# Altium schematic sheet Motor-Z.SchDoc: Motor-Z
size Letter; DocumentNumber: 4; SheetNumber: 7; SheetTotal: 11
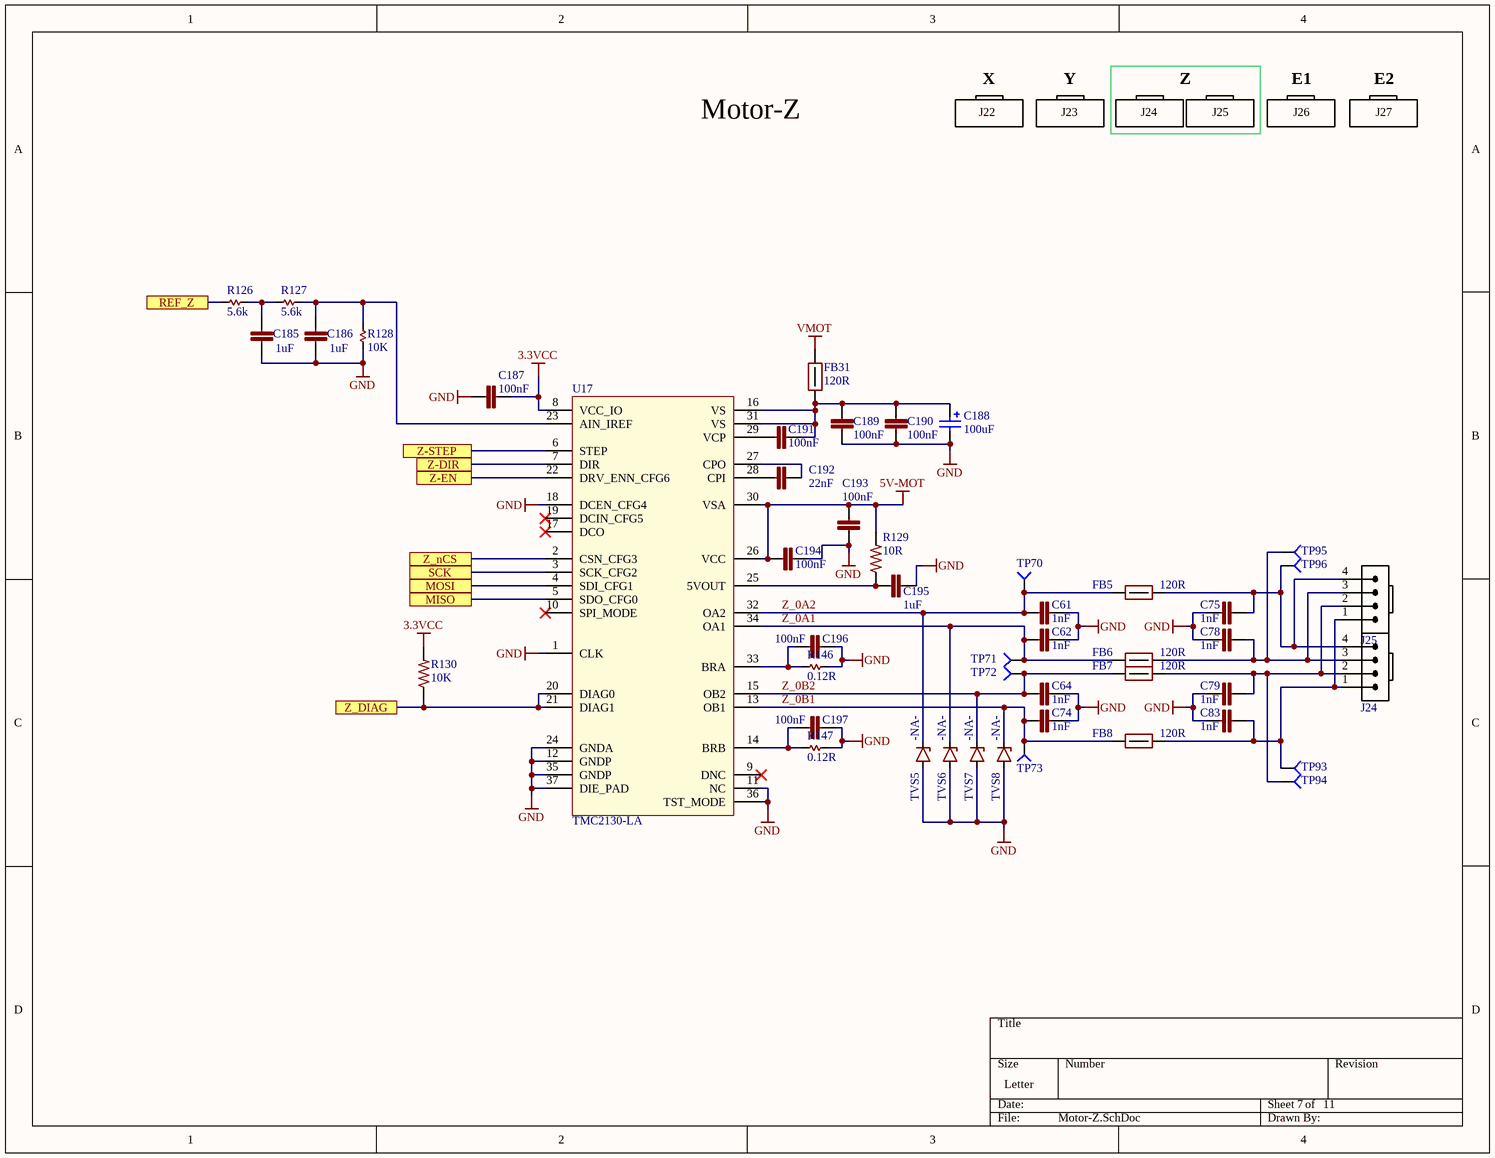
[diagram p0: Motor-Z.SchDoc]

## Parts
C61  1nF  [C0402]
C62  1nF  [C0402]
C64  1nF  [C0402]
C74  1nF  [C0402]
C75  1nF  [C0402]
C78  1nF  [C0402]
C79  1nF  [C0402]
C83  1nF  [C0402]
C185  1uF  [C0402]
C186  1uF  [C0402]
C187  100nF  [C0402]
C188  value 100uF  [CAP-ELEC-063063077]  (hidden comment: UWT1V101MCL1GS)
C189  100nF  [C0603]
C190  100nF  [C0603]
C191  100nF  [C0603]
C192  22nF  [C0402]
C193  100nF  [C0402]
C194  100nF  [C0402]
C195  1uF  [C0402]
C196  100nF  [C0603]
C197  100nF  [C0603]
FB5  120R  [FB0603]
FB6  120R  [FB0603]
FB7  120R  [FB0603]
FB8  120R  [FB0603]
FB31  120R  [FB0603]
J24  Molex 0705430038  [4POL254 PIN-IN-PASTE]  (value not drawn)
J25  Molex 0705430038  [4POL254 PIN-IN-PASTE]  (value not drawn)
R126  5.6k  [R0402]
R127  5.6k  [R0402]
R128  10K  [R0402]
R129  10R  [R0402]
R130  10K  [R0402]
R146  0.12R  [R1206]
R147  0.12R  [R1206]
TP70  TP4  [TP-2]  (value not drawn)  (no BOM)
TP71  TP4  [TP-2]  (value not drawn)  (no BOM)
TP72  TP4  [TP-2]  (value not drawn)  (no BOM)
TP73  TP4  [TP-2]  (value not drawn)  (no BOM)
TP93  TP4  [TP-2]  (value not drawn)  (no BOM)
TP94  TP4  [TP-2]  (value not drawn)  (no BOM)
TP95  TP4  [TP-2]  (value not drawn)  (no BOM)
TP96  TP4  [TP-2]  (value not drawn)  (no BOM)
TVS5  value -NA-  [SMF]  (hidden comment: TVS 30V SMF)
TVS6  value -NA-  [SMF]  (hidden comment: TVS 30V SMF)
TVS7  value -NA-  [SMF]  (hidden comment: TVS 30V SMF)
TVS8  value -NA-  [SMF]  (hidden comment: TVS 30V SMF)
U17  TMC2130-LA  [QFN36-50P500X600X900_HS-37N]

## Ports
MISO, MOSI, REF_Z, SCK, Z-DIR, Z-EN, Z-STEP, Z_DIAG, Z_nCS

## Nets
3.3VCC: C187.1 R130.2 U17.8(VCC_IO)
5V-MOT: C193.2 C194.2 R129.2 U17.26(VCC) U17.30(VSA)
GND: C61.2 C62.2 C64.2 C74.2 C75.1 C78.1 C79.1 C83.1 C185.2 C186.2 C187.2 C188.2 C189.1 C190.1 C193.1 C194.1 C195.2 C196.1 C197.1 R128.1 R146.2 R147.2 TVS5.A TVS6.A TVS7.A TVS8.A U17.1(CLK) U17.11(NC) U17.12(GNDP) U17.18(DCEN_CFG4) U17.24(GNDA) U17.35(GNDP) U17.36(TST_MODE) U17.37(DIE_PAD)
VMOT: FB31.2
MISO: U17.5(SDO_CFG0) ; port MISO
MOSI: U17.4(SDI_CFG1) ; port MOSI
REF_Z: R126.1 ; port REF_Z
SCK: U17.3(SCK_CFG2) ; port SCK
Z-DIR: U17.7(DIR) ; port Z-DIR
Z-EN: U17.22(DRV_ENN_CFG6) ; port Z-EN
Z-STEP: U17.6(STEP) ; port Z-STEP
Z_0A1: C62.1 FB6.1 TP71.1 TVS6.K U17.34(OA1)
Z_0A2: C61.1 FB5.1 TP70.1 TVS5.K U17.32(OA2)
Z_0B1: C74.1 FB8.1 TP73.1 TVS8.K U17.13(OB1)
Z_0B2: C64.1 FB7.1 TP72.1 TVS7.K U17.15(OB2)
Z_DIAG: R130.1 U17.20(DIAG0) U17.21(DIAG1) ; port Z_DIAG
Z_nCS: U17.2(CSN_CFG3) ; port Z_nCS
NetC75_2: C75.2 FB5.2 J24.4 J25.4 TP96.1
NetC78_2: C78.2 FB6.2 J24.3 J25.3 TP95.1
NetC79_2: C79.2 FB7.2 J24.2 J25.2 TP94.1
NetC83_2: C83.2 FB8.2 J24.1 J25.1 TP93.1
NetC185_1: C185.1 R126.2 R127.1
NetC186_1: C186.1 R127.2 R128.2 U17.23(AIN_IREF)
NetC188_1: C188.1 C189.2 C190.2 C191.2 FB31.1 U17.16(VS) U17.31(VS)
NetC191_1: C191.1 U17.29(VCP)
NetC192_1: C192.1 U17.28(CPI)
NetC192_2: C192.2 U17.27(CPO)
NetC195_1: C195.1 R129.1 U17.25(5VOUT)
NetC196_2: C196.2 R146.1 U17.33(BRA)
NetC197_2: C197.2 R147.1 U17.14(BRB)

Not connected (* = marked no-connect by the designer): U17 9(DNC)* 10(SPI_MODE)* 17(DCO)* 19(DCIN_CFG5)*

## Notes on the sheet
- X
- Y
- Z
- E1
- E2
- Motor-Z
- J22
- J23
- J24
- J25
- J26
- J27

## Library data of the parts
C61 C62 C64 C74 C75 C78 C79 C83 = CAP 1nF 50V 0402 X7R: 1000pF 50V Ceramic Capacitor X7R 0402 (1005 Metric) 0.039" L x 0.020" W (1.00mm x 0.50mm); MANUFACTURER: Murata; MANUFACTURER #: GRM155R71H102KA01D; PART: 1nF 50V X7R 0402; PART DESCRIPTION: 1000pF ±10% 50V Ceramic Capacitor X7R 0402 (1005 Metric); TOLERANCE: 10%; VALUE: 1nF; DISTRIBUTOR #: 490-1303-2-ND; DISTRIBUTOR: Digi-Key Electronics; EE_SPEC: 50V
C185 C186 = GRM155R60J105KE19D: CAP CER 0402 1uF 6.3V 10% X5R; MANUFACTURER: Murata; PART: 1uF 6.3V X5R 0402; PART DESCRIPTION: 1µF ±10% 6.3V Ceramic Capacitor X5R 0402 (1005 Metric); VALUE: 1uF; MANUFACTURER #: GRM155R60J105KE19D; DISTRIBUTOR #: 490-1320-2-ND; DISTRIBUTOR: Digi-Key Electronics; TOLERANCE: 10%; EE_SPEC: 1uF 6.3V X5R 0402
C187 C193 C194 = GRM155R71C104KA88D: CAP CER 0402 100nF 16V 10% X7R; Manufacturer: Murata; PART: 0.1uF 16V X7R 0402; Part Description: 0.10µF ±10% 16V Ceramic Capacitor X7R 0402 (1005 Metric); EE_SPEC: 100nF 16V X7R 0402; VALUE: 100nF; MANUFACTURER #: GRM155R71C104KA88D; DISTRIBUTOR #: 490-3261-2-ND; DISTRIBUTOR: Digi-Key Electronics; Tolerance: 10%
C188 = UWT1V101MCL1GS: CAP ALUM 100UF 35V 20% SMD; Manufacturer: Nichicon; PART: 100uF 35V SMD Al-El; Part Description: 100µF 35V Aluminum Capacitors Radial, Can - SMD 1000 Hrs @ 105°C; EE_SPEC: 100uF 35V Al-El; MANUFACTURER #: UWT1V101MCL1GS; DISTRIBUTOR #: 493-2203-2-ND; DISTRIBUTOR: Digi-Key Electronics; Tolerance: 20%
C189-C191 C196 C197 = C0603C104K5RACTU: CAP CER 0603 100nF 50V 10% X7R; Manufacturer: Kemet; Part Description: 0.1µF ±10% 50V Ceramic Capacitor X7R 0603 (1608 Metric); EE_SPEC: 100nF 50V X7R 0603; VALUE: 100nF; MANUFACTURER #: C0603C104K5RACTU; DISTRIBUTOR #: 399-5089-2-ND; DISTRIBUTOR: Digi-Key Electronics; PART: 100nF 50V X7R 0603; Tolerance: 10%
C192 = GCM155R71H223KA55D: CAP CER 0402 22nF ±10% 50V X7R; Manufacturer: YAGEO; Part Description: 0.022µF ±10% 50V Ceramic Capacitor X7R 0402 (1005 Metric); EE_SPEC: 22nF 50V X7R 0402; Tolerance: +/- 10%; VALUE: 22nF; MANUFACTURER #: GCM155R71H223KA55D; DISTRIBUTOR #: 490-4763-2-ND; DISTRIBUTOR: Digi-Key Electronics; PART: 22nF
C195 = GRM155R60J105KE19D: CAP CER 0402 1uF 6.3V 10% X5R; Manufacturer: Murata; Part Description: 1µF ±10% 6.3V Ceramic Capacitor X5R 0402 (1005 Metric); EE_SPEC: 1uF 6.3V X5R 0402; VALUE: 1uF; MANUFACTURER #: GRM155R60J105KE19D; DISTRIBUTOR #: 490-1320-2-ND; DISTRIBUTOR: Digi-Key Electronics; PART: 1uF 6.3V X5R 0402; Tolerance: 10%
FB5-FB8 = FERRITE 120R 3A 0603: FERRITE BEAD 120 OHM 0603 1LN; MANUFACTURER: Samsung; MANUFACTURER #: CIS10P121AC; MANUFACTURER2#: 490-5254-2-ND; VALUE: 120Rfb; TOLERANCE: -NA-; EE_SPEC: 3A; DISTRIBUTOR #: 1276-6351-2-ND; DISTRIBUTOR: Digi-Key Electronics; PART: FERRITE 120R 3A 0603; PART DESCRIPTION: FERRITE BEAD 120 OHM 0603 1LN
FB31 = FERRITE 120R 3A 0603: FERRITE BEAD 120 OHM 0603 1LN; MANUFACTURER: Samsung; MANUFACTURER #: CIS10P121AC; VALUE: 120Rfb; TOLERANCE: -NA-; EE_SPEC: 3A; DISTRIBUTOR #: 1276-6351-2-ND; DISTRIBUTOR: Digi-Key Electronics; PART: FERRITE 120R 3A 0603; PART DESCRIPTION: FERRITE BEAD 120 OHM 0603 1LN
J24 J25 = Molex 0705430003 PIP: Molex 4 Pin Clip Connector - Pin In Paste footprint
R126 R127 = 5.6k 1% 0402: RES SMD 5.6K OHM 1% 1/16W 0402; MANUFACTURER: YAGEO; MANUFACTURER #: RC0402FR-075K6L; PART DESCRIPTION: ±1% 0.063W, 1/16W Chip Resistor 0402 (1005 Metric) Moisture Resistant Thick Film; DISTRIBUTOR #: 311-5.6KLRTR-ND; DISTRIBUTOR: Digi-Key Electronics; PART: RES SMD 5.6K OHM 1% 1/16W 0402; TOLERANCE: 1%; EE_SPEC: 1/16W; VALUE: 5.6k
R128 = 10k 1% 0402: RES SMD 10K OHM 1% 1/16W 0402; MANUFACTURER: Yageo; MANUFACTURER #: RC0402FR-0710KP; PART DESCRIPTION: 10k Ohm ±1% 0.063W, 1/16W Chip Resistor 0402 (1005 Metric) Moisture Resistant Thick Film; DISTRIBUTOR #: YAG1249TR-ND; DISTRIBUTOR: Digi-Key Electronics; PART: 10k 1% 0402; TOLERANCE: 1%; EE_SPEC: 1/16W; VALUE: 10K
R129 = RC0402FR-0710RL: RES SMD 10 OHM 1% 1/16W 0402; Manufacturer: Yageo; Part Description: 10 Ohm ±1% 0.063W, 1/16W Chip Resistor 0402 (1005 Metric) Moisture Resistant Thick Film; EE_SPEC: 10R 1% 0402; VALUE: 10R; MANUFACTURER #: RC0402FR-0710RL; DISTRIBUTOR #: 311-10.0LRTR-ND; DISTRIBUTOR: Digi-Key Electronics; PART: 10R; Tolerance: 1%
R130 = RC0402FR-0710KP: RES SMD 10K OHM 1% 1/16W 0402; MANUFACTURER: Yageo; PART: 10k 1% 0402; PART DESCRIPTION: 10k Ohm ±1% 0.063W, 1/16W Chip Resistor 0402 (1005 Metric) Moisture Resistant Thick Film; VALUE: 10K; MANUFACTURER #: RC0402FR-0710KP; DISTRIBUTOR #: YAG1249TR-ND; DISTRIBUTOR: Digi-Key Electronics; TOLERANCE: 1%; EE_SPEC: 1/16W
R146 R147 = 0.12R 1% 1206: RES 0.12 OHM 1% 1/2W 1206; MANUFACTURER #: RL1206FR-7W0R12L; Part Description: 120 mOhms ±1% 0.5W, 1/2W Chip Resistor 1206 (3216 Metric) Automotive AEC-Q200, Current Sense, Moisture Resistant Thick Film; Tolerance: +/- 1%; DISTRIBUTOR #: 311-.12LYTR-ND; DISTRIBUTOR: Digi-Key; EE_SPEC: 0.12R 1% 1206; PART: 0.12R; VALUE: 0.12R
TP70-TP73 TP93-TP96 = Socket: MANUFACTURER #: NOTAPART-Testpoint
TVS5-TVS8 = TVS 30V SMF: TVS DIODE 30VWM 48.4VC SMF; MANUFACTURER: Vishay; MANUFACTURER #: SMF30A-E3-08; PART: TVS Diode 48.4VC; EE_SPEC: 30Vrs 48.4Vc; DISTRIBUTOR #: SMF30A-E3-08GITR-ND; DISTRIBUTOR: Digi-Key Electronics; PART DESCRIPTION: TVS DIODE 30VWM 48.4VC SMF; TOLERANCE: -NA-
U17 = TMC2130-LA-T: IC STEPPER MOTOR DVR SPI 36QFN; Manufacturer: Trinamic; Part Description: Bipolar Motor Driver Power MOSFET SPI, Step/Direction 36-QFN (5x6); EE_SPEC: 46V 1.2A 1/256 Step; Tolerance: NA; DISTRIBUTOR #: 1460-1130-2-ND; DISTRIBUTOR: Digi-Key Electronics; MANUFACTURER #: TMC2130-LA-T; PART: TMC2130; VALUE: TMC2130